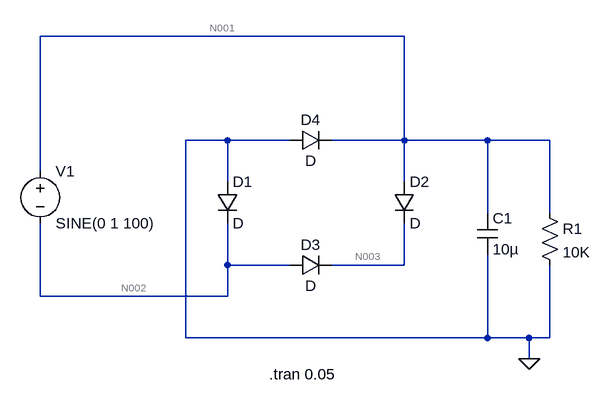
[diagram p0: schematic Draft2.asc]
Draft2.asc, the LTspice schematic file:
Version 4
SHEET 1 900 680
WIRE 608 -128 48 -128
WIRE 336 32 272 32
WIRE 432 32 336 32
WIRE 608 32 608 -128
WIRE 608 32 496 32
WIRE 736 32 608 32
WIRE 832 32 736 32
WIRE 48 80 48 -128
WIRE 336 96 336 32
WIRE 608 96 608 32
WIRE 736 144 736 32
WIRE 832 144 832 32
WIRE 336 224 336 160
WIRE 432 224 336 224
WIRE 608 224 608 160
WIRE 608 224 496 224
WIRE 48 272 48 160
WIRE 336 272 336 224
WIRE 336 272 48 272
WIRE 272 336 272 32
WIRE 736 336 736 208
WIRE 736 336 272 336
WIRE 800 336 736 336
WIRE 832 336 832 224
WIRE 832 336 800 336
WIRE 800 368 800 336
FLAG 800 368 0
SYMBOL diode 320 96 R0
SYMATTR InstName D1
SYMBOL diode 592 96 R0
SYMATTR InstName D2
SYMBOL diode 432 240 R270
WINDOW 0 32 32 VTop 2
WINDOW 3 0 32 VBottom 2
SYMATTR InstName D3
SYMBOL diode 432 48 R270
WINDOW 0 32 32 VTop 2
WINDOW 3 0 32 VBottom 2
SYMATTR InstName D4
SYMBOL voltage 48 64 R0
WINDOW 123 0 0 Left 0
WINDOW 39 0 0 Left 0
SYMATTR InstName V1
SYMATTR Value SINE(0 1 100)
SYMBOL res 816 128 R0
SYMATTR InstName R1
SYMATTR Value 10K
SYMBOL cap 720 144 R0
SYMATTR InstName C1
SYMATTR Value 10µ
TEXT 400 392 Left 2 !.tran 0.05

The netlist it stands for:
* Draft2.asc
D1 0 N002 D
D2 N001 N003 D
D3 N002 N003 D
D4 0 N001 D
V1 N001 N002 SINE(0 1 100)
R1 N001 0 10K
C1 N001 0 10µ
.model D D
.lib standard.dio
.tran 0.05
.backanno
.end

* Results of the author's LTspice run, read from the files saved beside the schematic
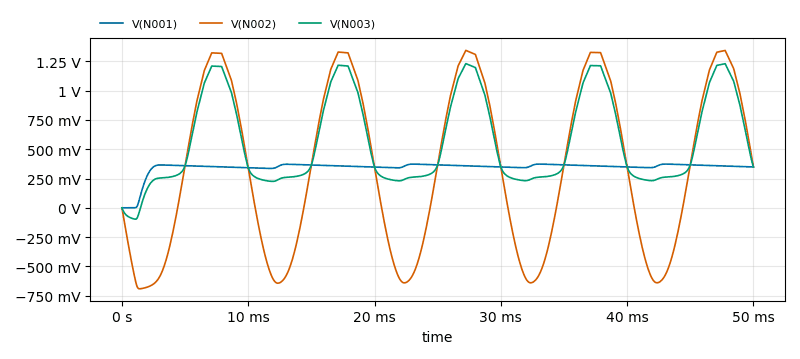
[diagram p1: Transient Analysis of Draft2.asc, plotted from the saved traces]
* Transient Analysis, 1 run:
*   V(N001): min 0 V, max 373.5 mV, average 344.6 mV, rms 350.1 mV, last 348.8 mV
*   V(N002): min -691 mV, max 1.344 V, average 340.5 mV, rms 791.1 mV, last 348.8 mV
*   V(N003): min -96.64 mV, max 1.231 V, average 567.5 mV, rms 687.4 mV, last 348.8 mV